# Altium schematic sheet TOF_Pulse.SchDoc
size A4; DocumentNumber: 1; SheetNumber: 1; SheetTotal: 2
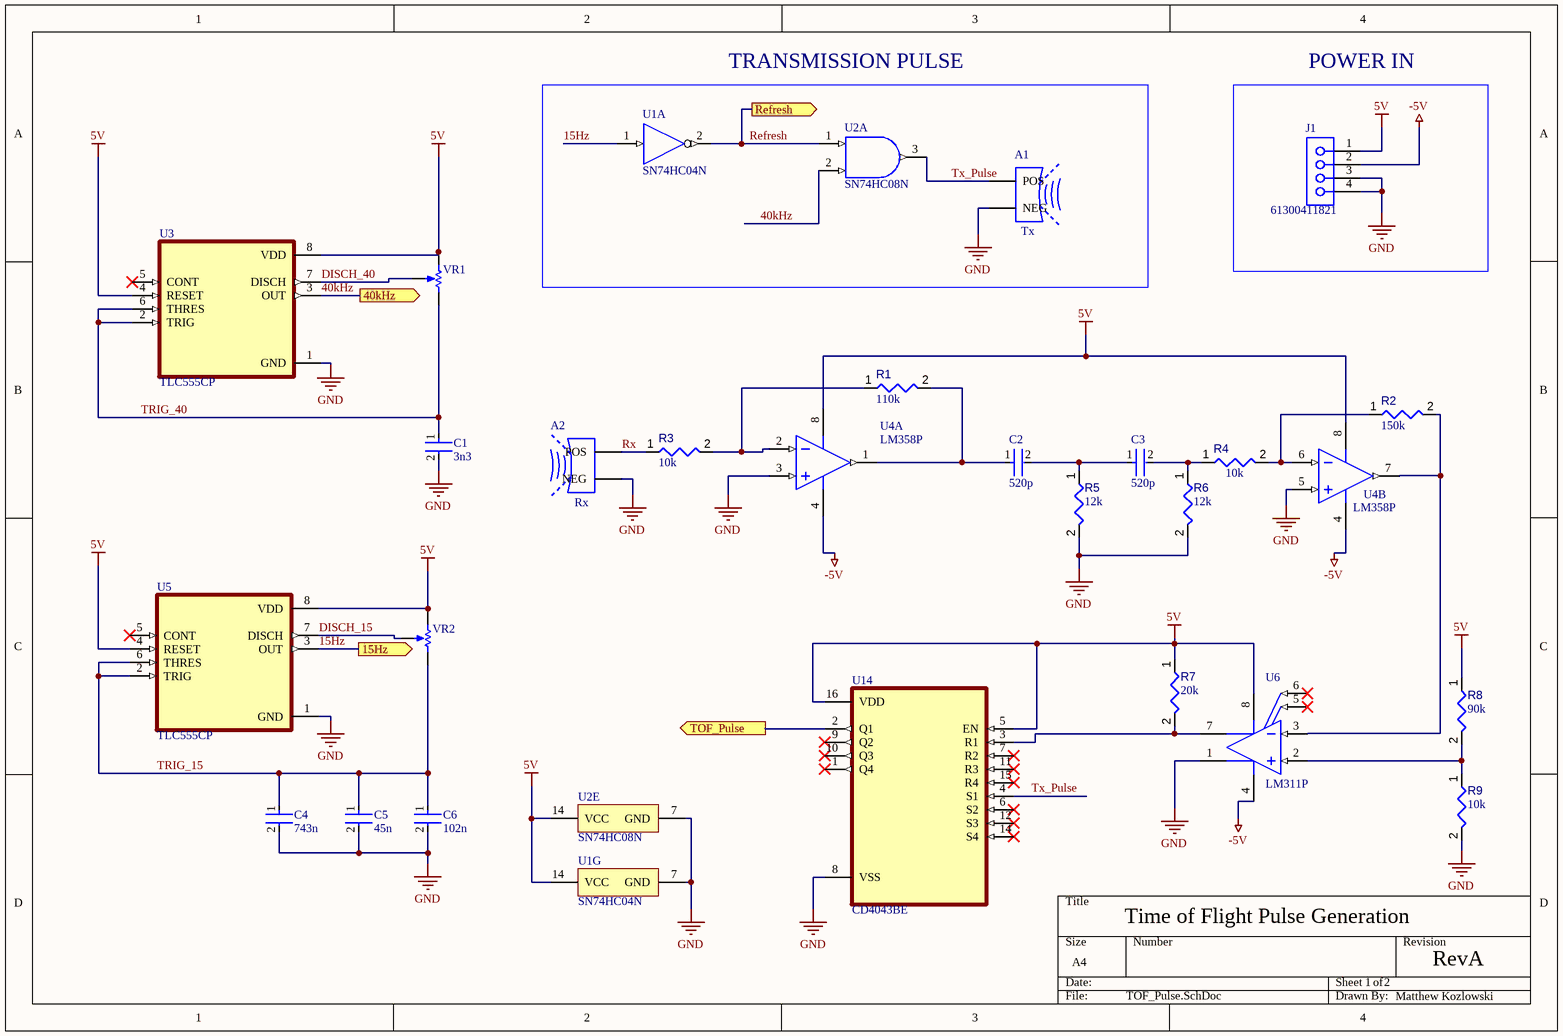
[diagram p0: TOF_Pulse.SchDoc]

## Parts
A1  Tx  [XDCR_CUSA-T80-12-2600-TH]
A2  Rx  [XDCR_CUSA-T80-12-2600-TH]
C1  3n3  [FP-K221K15X7RF5TL2-MFG]
C2  520p  [FP-K221K15X7RF5TL2-MFG]
C3  520p  [FP-K221K15X7RF5TL2-MFG]
C4  743n  [FP-K221K15X7RF5TL2-MFG]
C5  45n  [FP-K221K15X7RF5TL2-MFG]
C6  102n  [FP-K221K15X7RF5TL2-MFG]
J1  61300411821  [61300411821]
R1  value 110k  [RESC0805(2012)_L]  (hidden comment: 1KR5J)
R2  value 150k  [RESC0805(2012)_L]  (hidden comment: 1KR5J)
R3  value 10k  [RESC0805(2012)_L]  (hidden comment: 1KR5J)
R4  value 10k  [RESC0805(2012)_L]  (hidden comment: 1KR5J)
R5  value 12k  [RESC0805(2012)_L]  (hidden comment: 1KR5J)
R6  value 12k  [RESC0805(2012)_L]  (hidden comment: 1KR5J)
R7  value 20k  [RESC0805(2012)_L]  (hidden comment: 1KR5J)
R8  value 90k  [RESC0805(2012)_L]  (hidden comment: 1KR5J)
R9  value 10k  [RESC0805(2012)_L]  (hidden comment: 1KR5J)
U1  SN74HC04N  [N0014A]  (parts A,G of 7)
U2  SN74HC08N  [N0014A]  (parts A,E of 5)
U3  TLC555CP  [DIP794W45P254L959H508Q8]
U4  LM358P  [P0008A]  (parts A,B of 2)
U5  TLC555CP  [DIP794W45P254L959H508Q8]
U6  LM311P  [P0008A]
U14  CD4043BE  [DIP794W45P254L1969H508Q16]
VR1  3362P-1-103LF  [BOUR-3362P]  (value not drawn)
VR2  3362P-1-103LF  [BOUR-3362P]  (value not drawn)

## Blocks framed on the sheet
TRANSMISSION PULSE: A1 U1 U2
POWER IN: J1

## Ports
15Hz (out), 40kHz (out), Refresh (out, see Display[2B]), TOF_Pulse (out, see Display[2A])

## Nets
5V: J1.1 R7.1 R8.1 U1.14(VCC) U2.14(VCC) U3.4(RESET) U3.8(VDD) U4.8(VCC) U5.4(RESET) U5.8(VDD) U6.8(VCC+) U14.5(EN) U14.16(VDD) VR1.1(CCW) VR2.1(CCW)
-5V: J1.2 U4.4(GND) U6.4(VCC-)
GND: A1.N(NEG) A2.N(NEG) C1.2 C4.2 C5.2 C6.2 J1.3 J1.4 R5.2 R6.2 R9.2 U1.7(GND) U2.7(GND) U3.1(GND) U4.3(1IN+) U4.5(2IN+) U5.1(GND) U6.1(EMIT_OUT) U14.8(VSS)
15Hz: U1.1(1A) U5.3(OUT) ; port 15Hz
40kHz: U2.2(1B) U3.3(OUT) ; port 40kHz
DISCH_15: U5.7(DISCH) VR2.2(S)
DISCH_40: U3.7(DISCH) VR1.2(S)
Refresh: U1.2(~{1Y}) U2.1(1A) ; port Refresh
Rx: A2.P(POS) R3.1
TOF_Pulse: U14.2(Q1) ; port TOF_Pulse
TRIG_15: C4.1 C5.1 C6.1 U5.2(TRIG) U5.6(THRES) VR2.3(CW)
TRIG_40: C1.1 U3.2(TRIG) U3.6(THRES) VR1.3(CW)
Tx_Pulse: A1.P(POS) U2.3(1Y) U14.4(S1)
NetC2_1: C2.1 R1.2 U4.1(1OUT)
NetC2_2: C2.2 C3.1 R5.1
NetC3_2: C3.2 R4.1 R6.1
NetR1_1: R1.1 R3.2 U4.2(1IN-)
NetR2_1: R2.1 R4.2 U4.6(2IN-)
NetR2_2: R2.2 U4.7(2OUT) U6.3(IN-)
NetR7_2: R7.2 U6.7(COL_OUT) U14.3(R1)
NetR8_2: R8.2 R9.1 U6.2(IN+)

Not connected (* = marked no-connect by the designer): U3 5(CONT)*; U5 5(CONT)*; U6 5(BALANCE)* 6(BAL/STRB)*; U14 1(Q4)* 6(S2)* 7(R2)* 9(Q2)* 10(Q3)* 11(R3)* 12(S3)* 14(S4)* 15(R4)*

## Notes on the sheet
- Time of Flight Pulse Generation
- 1
- 2
- RevA
- Matthew Kozlowski

## Library data of the parts
A1 A2 = CMP-061-000000-1: ULTRASONIC SENSOR; Value: 0; Availability: Unavailable; Source: CUSA-T80-12-2600-TH.SchLib; MP: CUSA-T80-12-2600-TH; Package: None; Component Type: Standard; Pin Count: 2; Price: None; Design Item ID: CUSA-T80-12-2600-TH
C1-C6 = CMP-00030-39474895-1: K221K15X7RF5TL2 Multilayer Ceramic Capacitor, 220 pF, 50 V, ± 10%, X7R, Radial Leaded; Voltage Rating (DC): 50V; Lead Diameter: 500µm; Lead Length: 30mm; Lead/Base Style: Straight; Capacitance: 220pF; REACH SVHC: Unknown; Tolerance: 10%; Radiation Hardening: No; Depth: 2.6mm; Packaging: Cut Tape; Dielectric Material: Ceramic; Height: 4mm; Dielectric: X7R; Thickness: 2.6mm; Max Operating Temperature: 125°C; Weight: 160.004709mg; Height - Seated (Max): 5.588mm; Length: 4mm; Min Operating Temperature: -55°C; Case/Package: Dipped; Mount: Through Hole; Width: 2.4892mm; Number of Pins: 2; Diameter: 500µm; Voltage Rating: 50V; Termination: Radial; NexarPartId: 39474895; Lead Pitch: 2.5mm; RoHS: Compliant
J1 = CMP-1502-01316-2: NexarPartId: 61924712; Current Rating: 3A; Gender: Female; Operating Supply Voltage: 250V; Contact Resistance: 20mΩ; RoHS: Non-Compliant; Lead Pitch: 2.54mm; Orientation: Vertical; Number of Pins: 4
R1-R9 = CMP-009-00076-2: 1K 0.125W 5% 0805 (2012 Metric)  SMD; Power: 125mW; Pins: 2; Mounting Technology: SMT; Tolerance: 5%; Case/Package: 0805
U1 = CMP-1615-00892-2: Hex Inverters, N0014A, TUBE; Manufacturer: Texas Instruments; VCC(Min)(V): 2; Bits(#): 6; Technology Family: HC; tpd @ Nom Voltage(Max)(ns): 20; Output Drive (IOL/IOH)(Max)(mA): -4/4; Rating: Catalog; Voltage(Nom)(V): 5; Schmitt Trigger: No; ICC @ Nom Voltage(Max)(mA): 0.02; Input Type: CMOS; Code_JEDEC: MS-001; PackageReference: N0014A; DatasheetVersion: SCLS078F; Output Type: CMOS; VCC(Max)(V): 6; Operating Temperature Range(C): -40 to 85; Generic Part Number: SN74HC04; F @ Nom Voltage(Max)(Mhz): 20
U2 = CMP-0777-00250-3: Quadruple 2-Input Positive-AND Gates, N0014A, TUBE; Manufacturer: Texas Instruments; Output Type: CMOS; ICC @ Nom Voltage(Max)(mA): 0.02; tpd @ Nom Voltage(Max)(ns): 28; Voltage(Nom)(V): 5; VCC(Min)(V): 2; Technology Family: HC; F @ Nom Voltage(Max)(Mhz): 70; Rating: Catalog; Bits(#): 4; Schmitt Trigger: No; VCC(Max)(V): 6; PackageReference: N0014A; Input Type: CMOS; Generic Part Number: SN74HC08; DatasheetVersion: SCLS081F; Operating Temperature Range(C): -40 to 85
U3 U5 = CMP-007-000000-3: 2.1-MHz, 250-A, Low-Power Timer 8-PDIP 0 to 70; MF: Texas Instruments; Component Type: Standard; DigiKey-Purchase-URL: https://snapeda.com/shop?store=DigiKey&id=891867; SnapEDA_Link: https://www.snapeda.com/parts/TLC555CP/Texas%20Instruments/view-part/891867/?ref=snap; Digi-Key_Part_Number: TLC555CPW-ND; Design Item ID: TLC555CP; Source: TLC555CP.SchLib; MP: TLC555CP; Texas_Instruments-Purchase-URL: https://snapeda.com/shop?store=Texas+Instruments&id=891867; Value: *; Mouser-Purchase-URL: https://snapeda.com/shop?store=Mouser&id=891867; Pin Count: 8; Package: PDIP-8 Texas
U4 = CMP-2000-06549-1: Dual Operational Amplifier, 3 to 32 V, 0 to 70 degC, 8-Pin PDIP (P), RoHS, Tape and Reel; Manufacturer: Technik Industrial; Datasheet Version: Rev. T, 04/2015; Datasheet URL: http://www.ti.com/lit/ds/symlink/lm358.pdf; Manufacturer URL: http://www.technik.com.hk/; Package Description: 8-Pin Double In-line Package, Body 9.59 x 6.35 mm, Pitch 2.54 mm; Mounting Technology: ThroughHole; Package URL: http://www.ti.com/lit/ml/mpdi001b/mpdi001b.pdf; Package Reference: P8
U6 = CMP-1685-00016-1: Quad Differential Comparator, 3.5 to 30 V, 0 to 70 degC, 8-Pin PDIP (P), Pb-Free (RoHS), Tube; Power Rating: 100 mW; Tolerance: 1%; Resistance: 390 Ohm; Voltage Rating: 75 V; Case\Package: 0603; Pins: 2; Mount: Surface Mount; Weight: 7.1E-05 oz; RoHSCompliant: true; DatasheetVersion: SLCS007I, 06/2015; ComponentLink1Description: Manufacturer URL; REACH SVHC: Unknown; Max Operating Temperature: 155 degC; PackageVersion: 4040082/E, 04/2010; Length: 1.6 mm; Package Quantity: 5000; ComponentLink3URL: http://www.ti.com/lit/ml/mpdi001b/mpdi001b.pdf; Height: 0.45 mm; ComponentLink2Description: Datasheet; Width: 0.8 mm; ComponentLink1URL: http://www.ti.com/; ComponentLink2URL: http://www.ti.com/general/docs/lit/getliterature.tsp?genericPartNumber=LM311&fileType=pdf; Packaging: Tape and Reel; ComponentLink3Description: Package Specification; Radiation Hardening: No; Case Code (Metric): 1608; Case Code (Imperial): 0603; PackageReference: P0008A; Min Operating Temperature: -55 degC; PackageDescription: 8-Pin Double In-line Package, Body 9.59 x 6.35 mm, Pitch 2.54 mm
U14 = CMP-030-000002-2: CMOS Quad NOR R/S Latch with 3-State Outputs 16-PDIP -55 to 125; MF: Texas Instruments; Texas_Instruments-Purchase-URL: https://snapeda.com/shop?store=Texas+Instruments&id=577167; MP: CD4043BE; DigiKey-Purchase-URL: https://snapeda.com/shop?store=DigiKey&id=577167; Mouser-Purchase-URL: https://snapeda.com/shop?store=Mouser&id=577167; Pin Count: 15; Component Type: Standard; Value: *; Availability: Good; Source: CD4043BE.SchLib; SnapEDA_Link: https://www.snapeda.com/parts/CD4043BE/Texas%20Instruments/view-part/577167/?ref=snap; Price: None; Arrow_Electronics-Purchase-URL: https://snapeda.com/shop?store=Arrow+Electronics&id=577167; Design Item ID: CD4043BE; Package: PDIP-16 Texas Instruments
VR1 VR2 = CMP-009-00039-2: Square Trimpot(R) Trimming Potentiometer, 10 KOhm, 300 V, -55 to 125 degC, 3-Pin THD, RoHS, Tube; Manufacturer: Bourns; Tolerance: 10%; Power: 500mW; Voltage Rating: 300V; Resistance: 10k; Packaging: Rail/Tube; Package Reference: 3326P; Manufacturer URL: http://www.bourns.com/; Composition: Potentiometer; Package Description: 3-Pin Through Hole Device, Body 6.6 x 6.99 mm, Pitch 2.54 mm; Max Operating Temperature: 125°C; Min Operating Temperature: -55°C; Datasheet Version: May-16; Lead Pitch: 2.54mm; Pins: 3; Datasheet URL: http://www.bourns.com/docs/Product-Datasheets/3362.pdf; Package Quantity: 250; Case/Package: 3326P; RoHS Compliant: True; Mounting Technology: TH